# EAGLE schematic WifiTracker (EAGLE 9.3.2)
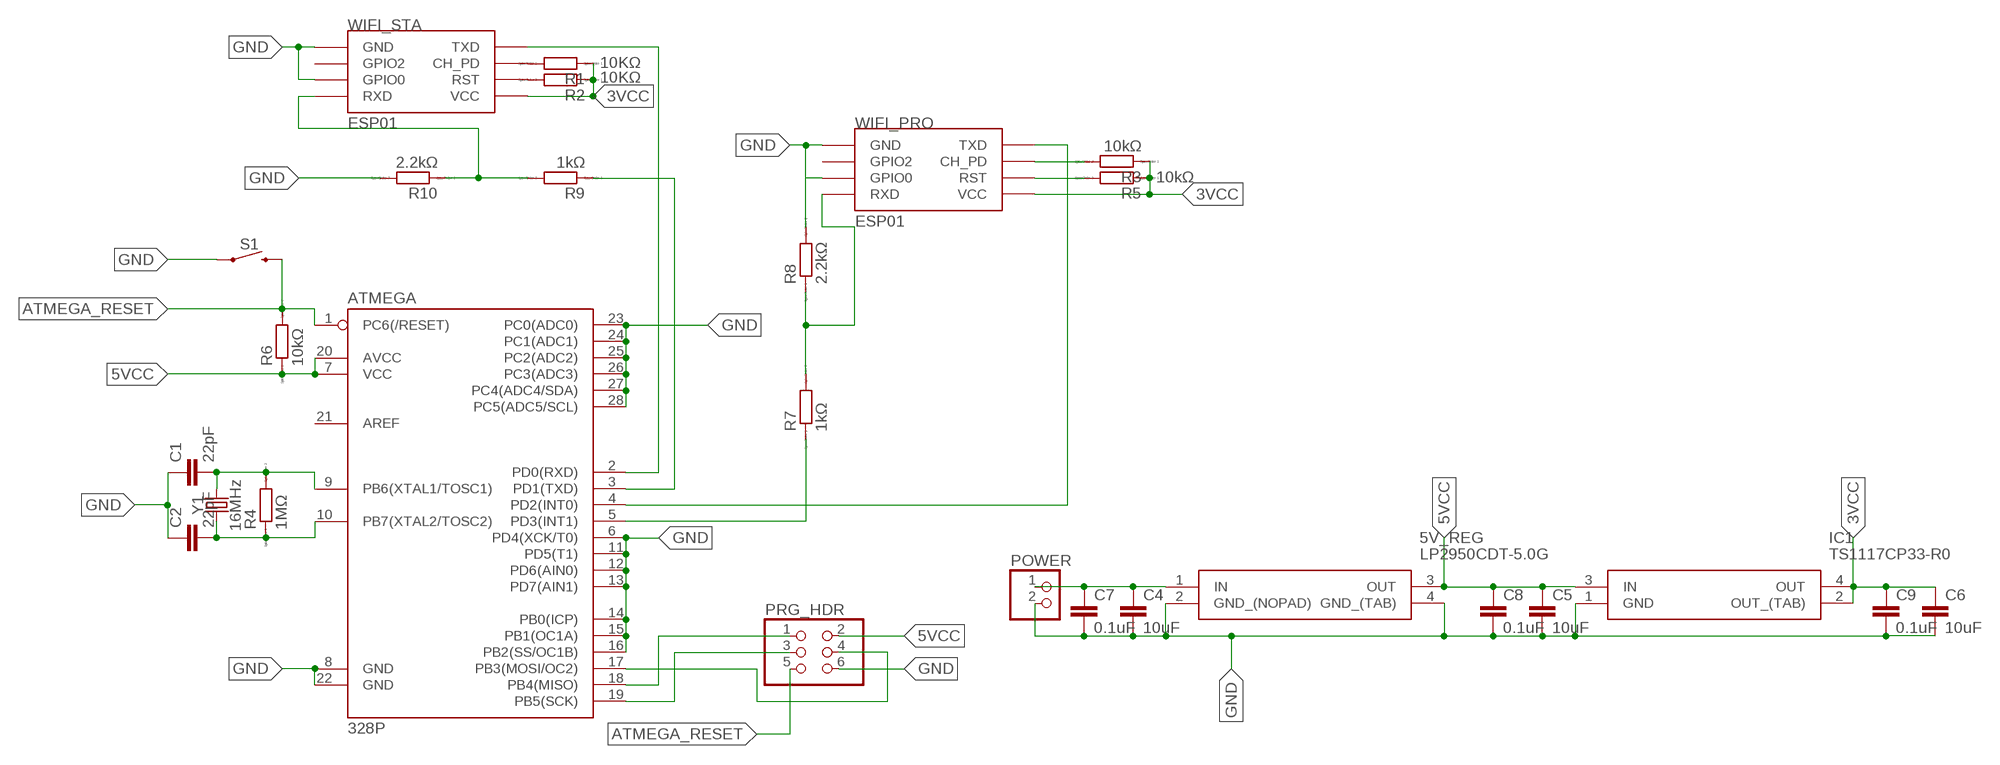
[diagram p0: schematic, sheet 1]

## Parts
5V_REG  LP2950CDT-5.0G  [TO229P990X238-4N]
ATMEGA  328P  ATMEGA328P_PDIP  [DIP28]
C1  22pF  1.0UF-1206-50V-10%  [1206]
C2  22pF  1.0UF-1206-50V-10%  [1206]
C4  10uF  1.0UF-1206-50V-10%  [1206]
C5  10uF  1.0UF-1206-50V-10%  [1206]
C6  10uF  1.0UF-1206-50V-10%  [1206]
C7  0.1uF  1.0UF-1206-50V-10%  [1206]
C8  0.1uF  1.0UF-1206-50V-10%  [1206]
C9  0.1uF  1.0UF-1206-50V-10%  [1206]
IC1  TS1117CP33-R0  [TO229P990X238-4N]
POWER  PINHD-1X2  [1X02]
PRG_HDR  PINHD-2X3  [2X03]
R1  10KΩ  RR1210  [R1210]
R2  10KΩ  RR1210  [R1210]
R3  10kΩ  RR1210  [R1210]
R4  1MΩ  RR1210  [R1210]
R5  10kΩ  RR1210  [R1210]
R6  10kΩ  RR1210  [R1210]
R7  1kΩ  RR1210  [R1210]
R8  2.2kΩ  RR1210  [R1210]
R9  1kΩ  RR1210  [R1210]
R10  2.2kΩ  RR1210  [R1210]
S1  MOMENTARY-SWITCH-SPST-PTH-6.0MM  [TACTILE_SWITCH_PTH_6.0MM]
WIFI_PRO  ESP01  [ESP01]
WIFI_STA  ESP01  [ESP01]
Y1  16MHz  CRYSTAL-8MHZSMD-HC49UP  [HC49UP]

## Nets
3VCC [power]: C6.1 C9.1 IC1.2(OUT_(TAB)) IC1.4(OUT) R1.1 R2.1 R3.1 R5.1 WIFI_PRO.VCC WIFI_STA.VCC
5VCC [power]: 5V_REG.3(OUT) ATMEGA.7(VCC) ATMEGA.20(AVCC) C5.1 C8.1 IC1.3(IN) PRG_HDR.2 R6.1
AT_STXD: ATMEGA.5(PD3(INT1)) R7.1
AT_TXD: ATMEGA.3(PD1(TXD)) R9.1
ATMEGA_RESET: ATMEGA.1(PC6(/RESET)) PRG_HDR.5 R6.2 S1.3
GND [power]: 5V_REG.2(GND_(NOPAD)) 5V_REG.4(GND_(TAB)) ATMEGA.6(PD4(XCK/T0)) ATMEGA.8(GND) ATMEGA.11(PD5(T1)) ATMEGA.12(PD6(AIN0)) ATMEGA.13(PD7(AIN1)) ATMEGA.14(PB0(ICP)) ATMEGA.15(PB1(OC1A)) ATMEGA.16(PB2(SS/OC1B)) ATMEGA.22(GND) ATMEGA.23(PC0(ADC0)) ATMEGA.24(PC1(ADC1)) ATMEGA.25(PC2(ADC2)) ATMEGA.26(PC3(ADC3)) ATMEGA.27(PC4(ADC4/SDA)) ATMEGA.28(PC5(ADC5/SCL)) C1.1 C2.1 C4.2 C5.2 C6.2 C7.2 C8.2 C9.2 IC1.1(GND) POWER.2 PRG_HDR.6 R8.2 R10.2 S1.1 WIFI_PRO.GND WIFI_PRO.GPIO0 WIFI_STA.GND WIFI_STA.GPIO0
MISO: ATMEGA.18(PB4(MISO)) PRG_HDR.1
MOSI: ATMEGA.17(PB3(MOSI/OC2)) PRG_HDR.4
PRO_CH_PD: R3.2 WIFI_PRO.CH_PD
PRO_RST: R5.2 WIFI_PRO.RST
PRO_RXD: R7.2 R8.1 WIFI_PRO.RX(RXD)
PRO_TXD: ATMEGA.4(PD2(INT0)) WIFI_PRO.TX(TXD)
SCK: ATMEGA.19(PB5(SCK)) PRG_HDR.3
STA_CH_PD: R1.2 WIFI_STA.CH_PD
STA_RST: R2.2 WIFI_STA.RST
STA_RXD: R9.2 R10.1 WIFI_STA.RX(RXD)
STA_TXD: ATMEGA.2(PD0(RXD)) WIFI_STA.TX(TXD)
VIN [power]: 5V_REG.1(IN) C4.1 C7.1 POWER.1
XTAL1: ATMEGA.9(PB6(XTAL1/TOSC1)) C1.2 R4.2 Y1.2
XTAL2: ATMEGA.10(PB7(XTAL2/TOSC2)) C2.2 R4.1 Y1.1
Unconnected: ATMEGA.21(AREF) WIFI_PRO.GPIO2 WIFI_STA.GPIO2

## Library data of the parts
5V_REG = LP2950CDT-5.0G:LP2950CDT-5.0G: Source: Datasheet <http://www.onsemi.com/pub/Collateral/LP2950-D.PDF>; ALLIED_NUMBER: 70100442; ALLIED_PRICE-STOCK: http://www.alliedelec.com/on-semiconductor-lp2950cdt-5-0g/70100442/; HEIGHT: 2.38mm; MANUFACTURER_NAME: ON Semiconductor; MANUFACTURER_PART_NUMBER: LP2950CDT-5.0G; MOUSER_PART_NUMBER: 863-LP2950CDT-5.0G; MOUSER_PRICE-STOCK: https://www.mouser.com/Search/Refine.aspx?Keyword=863-LP2950CDT-5.0G; RS_PART_NUMBER: 0463593P; RS_PRICE-STOCK: http://uk.rs-online.com/web/p/products/0463593P
ATMEGA = SparkFun-IC-Microcontroller:ATMEGA328P_PDIP: Atmel 328P Through hole ATMEGA328P uC used in the Arduino 32kb flash, 1k EEPROM, 2k SRAM Datasheet <http://www.sparkfun.com/datasheets/Components/SMD/ATMega328.pdf> SparkFun Products Storefront component: AVR 28 Pin 20MHz 32K 6A/D - ATMega328P <https://www.sparkfun.com/products/9061> (COM-09061) SparkFun Simon Says - Through-Hole Soldering Kit <https://www.sparkfun.com/products/10547> (KIT-10547) SparkFun Learn to Solder - Simon Says <https://www.sparkfun.com/products/13708> (KIT-13708) SparkFun BigTime Watch Kit <https://www.sparkfun.com/products/11734> (KIT-11734) SparkFun ClockIt <https://www.sparkfun.com/products/10930> (KIT-10930) SparkFun Serial Enabled LCD Kit <https://www.sparkfun.com/products/10097> (LCD-10097) SparkFun Simon Tilts - Through Hole Soldering Kit <https://www.sparkfun.com/products/12634> (KIT-12634) SparkFun Frequency Counter Kit <https://www.sparkfun.com/products/10140> (KIT-10140) FabFM Radio Kit <https://www.sparkfun.com/products/11043> (KIT-11043) SparkFun Binary Blaster Kit <https://www.sparkfun.com/products/12037> (KIT-12037) SparkFun Metro-Gnome <https://www.sparkfun.com/products/9236> (KIT-09236) ATmega328 with Arduino Optiboot (Uno) <https://www.sparkfun.com/products/10524> (DEV-10524); PROD_ID: IC-09136
C1 C2 C4-C9 = SparkFun-Capacitors:1.0UF: 1µF ceramic capacitors A capacitor is a passive two-terminal electrical component used to store electrical energy temporarily in an electric field.; PROD_ID: CAP-09822; VALUE: 1.0uF
IC1 = TS1117CP33-R0:TS1117CP33-R0: Source: Datasheet <http://www.onsemi.com/pub/Collateral/LP2950-D.PDF>; ALLIED_NUMBER: 70100442; ALLIED_PRICE-STOCK: http://www.alliedelec.com/on-semiconductor-lp2950cdt-5-0g/70100442/; HEIGHT: 2.38mm; MANUFACTURER_NAME: ON Semiconductor; MANUFACTURER_PART_NUMBER: LP2950CDT-5.0G; MOUSER_PART_NUMBER: 863-LP2950CDT-5.0G; MOUSER_PRICE-STOCK: https://www.mouser.com/Search/Refine.aspx?Keyword=863-LP2950CDT-5.0G; RS_PART_NUMBER: 0463593P; RS_PRICE-STOCK: http://uk.rs-online.com/web/p/products/0463593P
POWER = pinhead:PINHD-1X2: PIN HEADER
PRG_HDR = pinhead:PINHD-2X3: PIN HEADER
R1-R10 = eagle-ltspice:R: RESISTOR, European symbol; SPICEMODEL: NONE; SPICEPREFIX: R
S1 = SparkFun-Switches:MOMENTARY-SWITCH-SPST: Momentary Switch (Pushbutton) - SPST Normally-open (NO) SPST momentary switches (buttons, pushbuttons). Variants PTH-12MM - 12mm square, through-hole Momentary Pushbutton Switch - 12mm Square <https://www.sparkfun.com/products/9190> (COM-09190) PTH-6.0MM, PTH-6.0MM-KIT - 6.0mm square, through-hole Mini Pushbutton Switch <https://www.sparkfun.com/products/97> (COM-00097) KIT package intended for soldering kit's - only one side of pads' copper is exposed. PTH-RIGHT-ANGLE-KIT - Right-angle, through-hole Right Angle Tactile Button <https://www.sparkfun.com/products/10791> - Used on SparkFun BigTime Watch Kit <https://www.sparkfun.com/products/11734> SMD-12MM - 12mm square, surface-mount Tactile Button - SMD (12mm) <https://www.sparkfun.com/products/12993> (COM-12993) Used on SparkFun PicoBoard <https://www.sparkfun.com/products/11888> SMD-4.5MM - 4.5mm Square Trackball Switch Used on SparkFun Blackberry Trackballer Breakout <https://www.sparkfun.com/products/13169> SMD-4.6MMX2.8MM - 4.60mm x 2.80mm, surface mount Used on SparkFun SAMD21 Mini Breakout <https://www.sparkfun.com/products/13664> SMD-5.2MM, SMD-5.2-REDUNDANT - 5.2mm square, surface-mount Mini Pushbutton Switch - SMD <https://www.sparkfun.com/products/8720> (COM-08720) Used on Arduino Pro Mini <https://www.sparkfun.com/products/11114> REDUNDANT package connects both switch circuits together SMD-6.0X3.5MM - 6.0 x 3.5mm, surface mount Momentary Reset Switch SMD <https://www.sparkfun.com/products/8229> (COM-08229) SMD-6.2MM-TALL - 6.2mm square, surface mount Tactile Button - SMD (6mm) <https://www.sparkfun.com/products/12992> Used on SparkFun Digital Sandbox <https://www.sparkfun.com/products/12651> SMD-RIGHT-ANGLE - Right-angle, surface mount Used on SparkFun Block for Intel® Edison - Arduino <https://www.sparkfun.com/products/13036>; PROD_ID: SWCH-08441; SF_SKU: COM-00097
WIFI_PRO WIFI_STA = esp8266modules:ESP01: ESP8266 Wifi module 01
Y1 = SparkFun-Clocks:CRYSTAL-8MHZ: 8MHz Crystal Datasheet Example <http://www.futureelectronics.com/en/technologies/electromechanical/timing-devices/crystals/Pages/6008189-ABM3B-8.000MHZ-B2-T.aspx?IM=0> Frequency: 8MHz Frequency Tolerance: ±20ppm Load Capacitance: 18pF SparkFun Products: Pro Micro -3.3V/8MHz <https://www.sparkfun.com/products/12587> WAV Trigger <https://www.sparkfun.com/products/13660>; PROD_ID: XTAL-11706; VALUE: 8MHz

## Net classes
0 default: width 0.406 mm, drill 0.203 mm, clearance 0.203 mm
1 power: width 0.813 mm, drill 0.203 mm, clearance 0.203 mm
2 text: width 0.203 mm, drill 0.203 mm, clearance 0.203 mm